# Altium schematic sheet Circuit.SchDoc
size A4
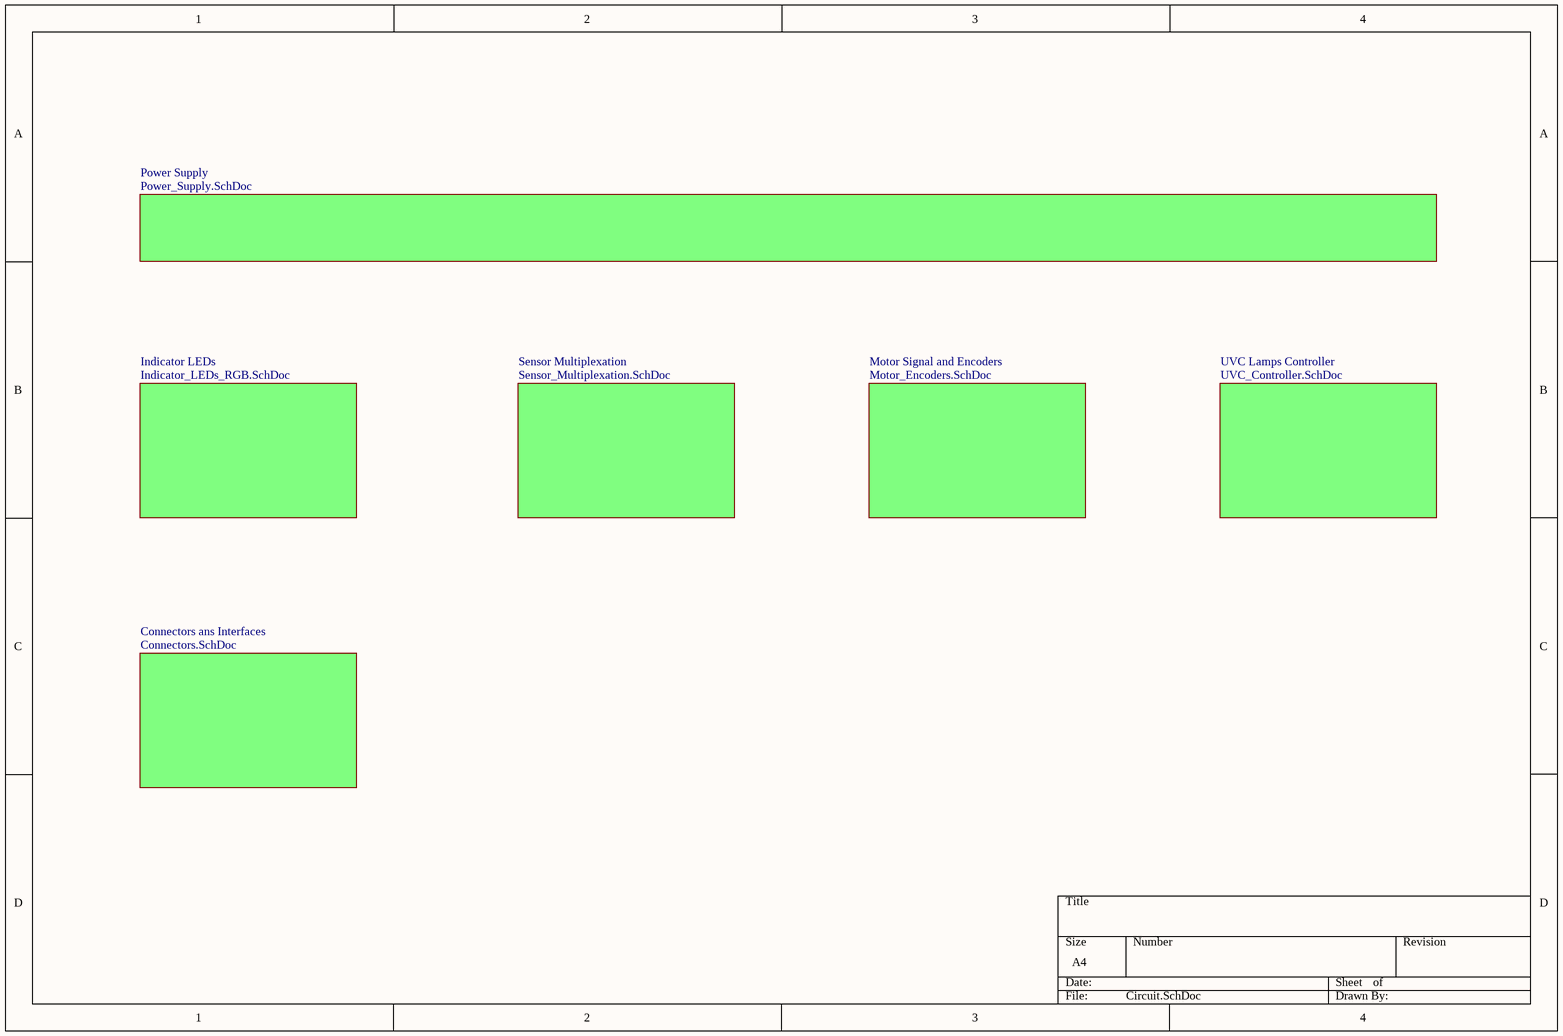
[diagram p0: Circuit.SchDoc]

## Sub-sheets
Connectors ans Interfaces = Connectors.SchDoc: no entries
Indicator LEDs = Indicator_LEDs_RGB.SchDoc: no entries
Motor Signal and Encoders = Motor_Encoders.SchDoc: no entries
Power Supply = Power_Supply.SchDoc: no entries
Sensor Multiplexation = Sensor_Multiplexation.SchDoc: no entries
UVC Lamps Controller = UVC_Controller.SchDoc: no entries